# EAGLE design DESIGN7RA (EAGLE 9.6.1)
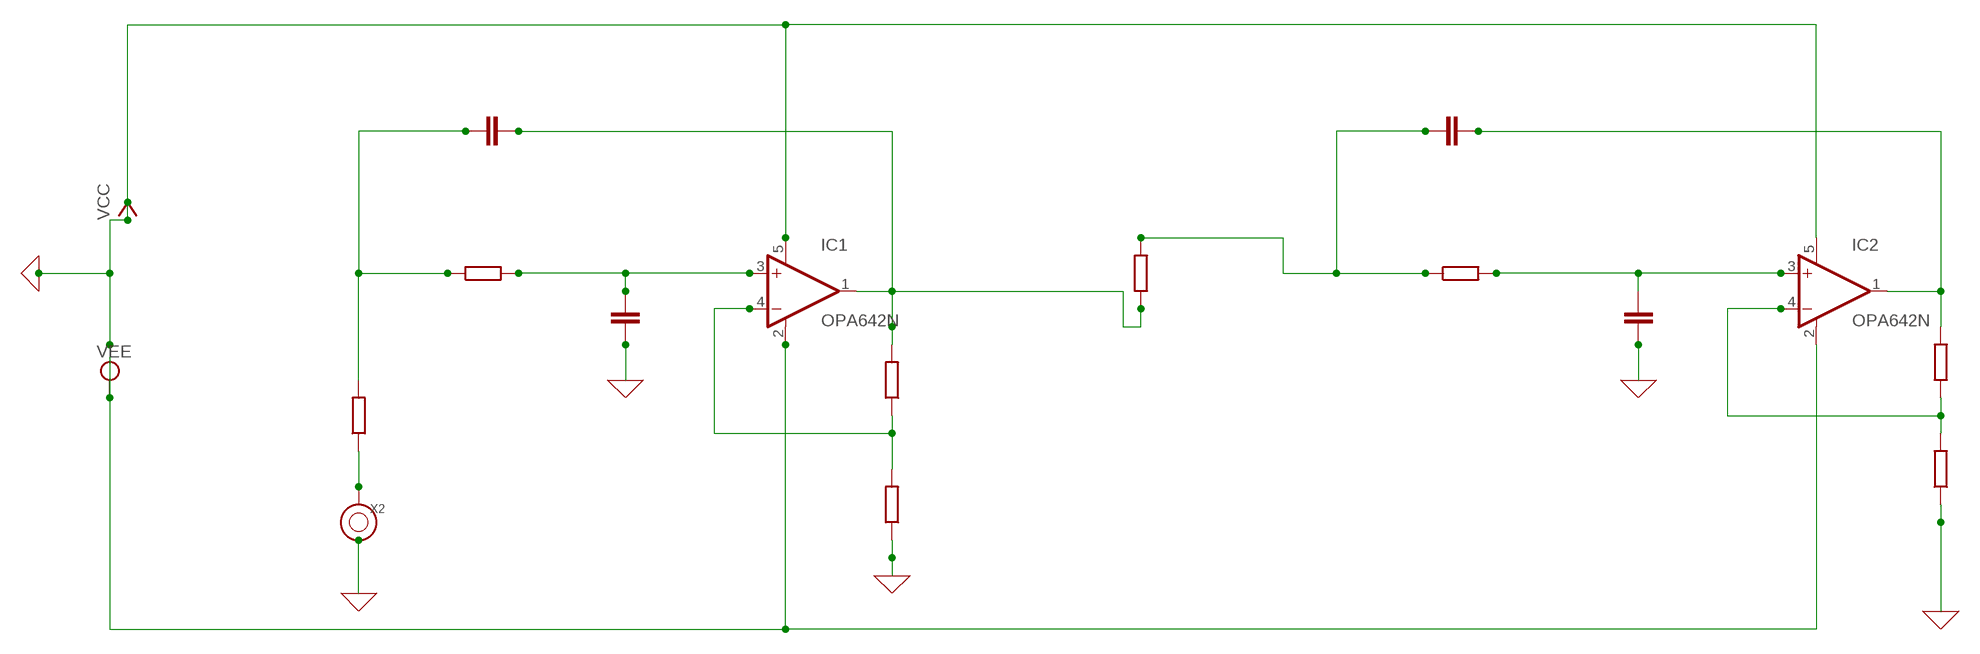
[diagram p0: schematic, sheet 1]

## Parts
IC1  OPA642N  [SOT23-5]
IC2  OPA642N  [SOT23-5]
X2  BINDING-POST  [BINDING-POST]

## Nets
0: IC1.2(V-) IC1.5(V+) IC2.2(V-) IC2.5(V+) ; supply symbol labelled GND, VCC, VEE
N$1: IC1.3(+IN)
N$2: IC1.1(OUT)
N$3: IC1.4(-IN)
N$4: IC2.1(OUT)
N$5: IC2.4(-IN)
N$7: IC2.3(+IN)
N$9: X2.1 X2.1_1 X2.1_2 X2.1_3 X2.1_4 X2.1_5 X2.1_6 X2.1_7 X2.1_8

## Library data of the parts
IC1 IC2 = burr-brown:OPA642N: Operational Amplifier Wideband, Low Distortion; OC_FARNELL: unknown; OC_NEWARK: unknown
X2 = binding-post_10:BINDING-POST: Binding post

## Board
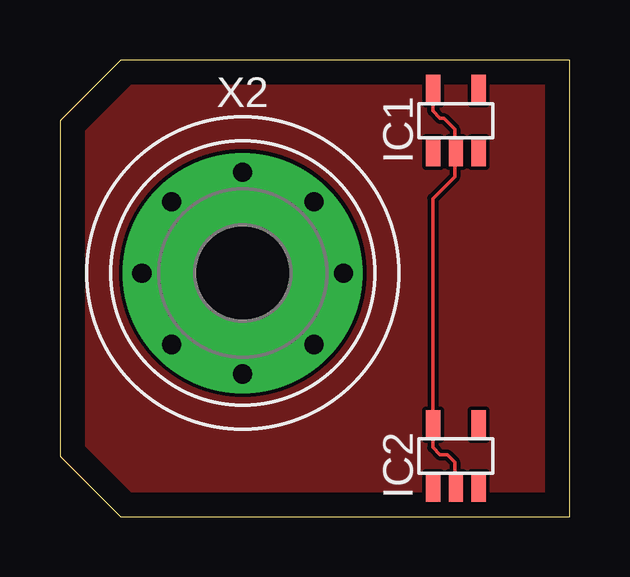
[diagram p1: board, top side]
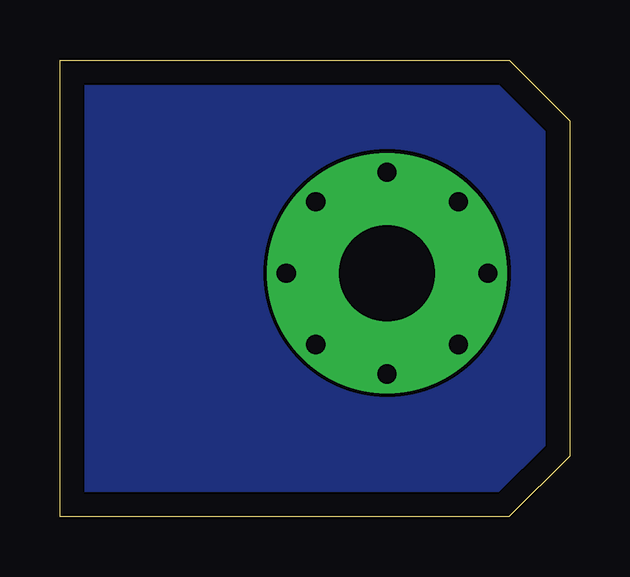
[diagram p2: board, bottom side, seen from below]

Size 21.26 x 19.04 mm. Coordinates in mm from the lower left corner, seen from the top.
Outline: 0,16.51 0,2.54 2.54,0 21.26,0 21.26,19.04 2.53,19.04 0,16.51
Copper layers (1*16): Top 0.035mm / dielectric 1.5mm / Bottom 0.035mm
Design rules "default": minimum track width 6mil, minimum drill 0.35mm, track to track 6mil, track to pad 6mil, pad to pad 6mil, via to via 6mil, smd to smd 6mil, copper to edge 40mil, drill to drill 6mil, minimum pad ring 10mil, minimum via ring 8mil, stop-mask expansion 4mil, vias tented up to drill 0mil, thermal gap 10mil

### Footprints (pad centres in the part's own frame; a part is rotated, then mirrored left to right if it is on the bottom)
SOT23-5 = smd 0.6 x 1.2: 1 -0.95,-1.306; 2 0,-1.306; 3 0.95,-1.306; 4 0.95,1.306; 5 -0.95,1.306
BINDING-POST = drill 4 pad 10: 1 0,0 | drill 0.8 pad 0.9: 1_1 4.2,0; 1_2 2.97,2.97; 1_3 0,4.2; 1_4 -2.97,2.97; 1_5 -4.2,0; 1_6 -2.97,-2.97; 1_7 0,-4.2; 1_8 2.97,-2.97

### Placement (x,y rotation side)
IC1  16.51,16.51 0 top
IC2  16.51,2.54 0 top
X2  7.62,10.16 0 top

### Tracks (layer width: path | path; a pad name or v marks a point on that pad's centre or on a via)
0
  Top 0.152: IC2.2 16.46,1.37 16.46,2.29 16.15,2.59 15.85,2.59 15.54,2.9 15.54,3.81 IC2.5 15.54,3.96 15.54,13.26 16.46,14.17 16.46,15.09 IC1.2 16.46,15.24 16.46,16.15 16,16.61 15.85,16.61 15.54,16.92 15.54,17.68 IC1.5
BOTTOMGND
  pour Bottom: 2.54,19.05 0,16.51 0,2.54 2.54,0 21.59,0 21.59,19.05
N$9
  Top 0.152: 10.67,8.99 10.67,7.32 X2.1_8 | 10.67,8.99 11.73,10.06 X2.1_1 11.73,10.21 10.67,11.28 10.67,13.11 X2.1_2 10.52,13.26 8.69,13.26 7.62,14.33 | X2.1_7 7.62,6.1 5.79,6.1 4.72,7.16 X2.1_6 4.57,7.32 3.5,8.38 3.5,10.06 X2.1_5 3.5,10.21 4.57,11.28 4.57,13.11 X2.1_4 4.72,13.26 5.79,14.33 7.62,14.33 | 7.62,14.33 X2.1_3 | 10.67,8.99 8.69,8.99 7.62,10.06 X2.1
TOPGND
  pour Top: 2.54,19.05 0,16.51 0,2.54 2.54,0 21.59,0 21.59,19.05